# EAGLE design mpg-200-prototype_v3-with-logo (EAGLE 7.2.0)
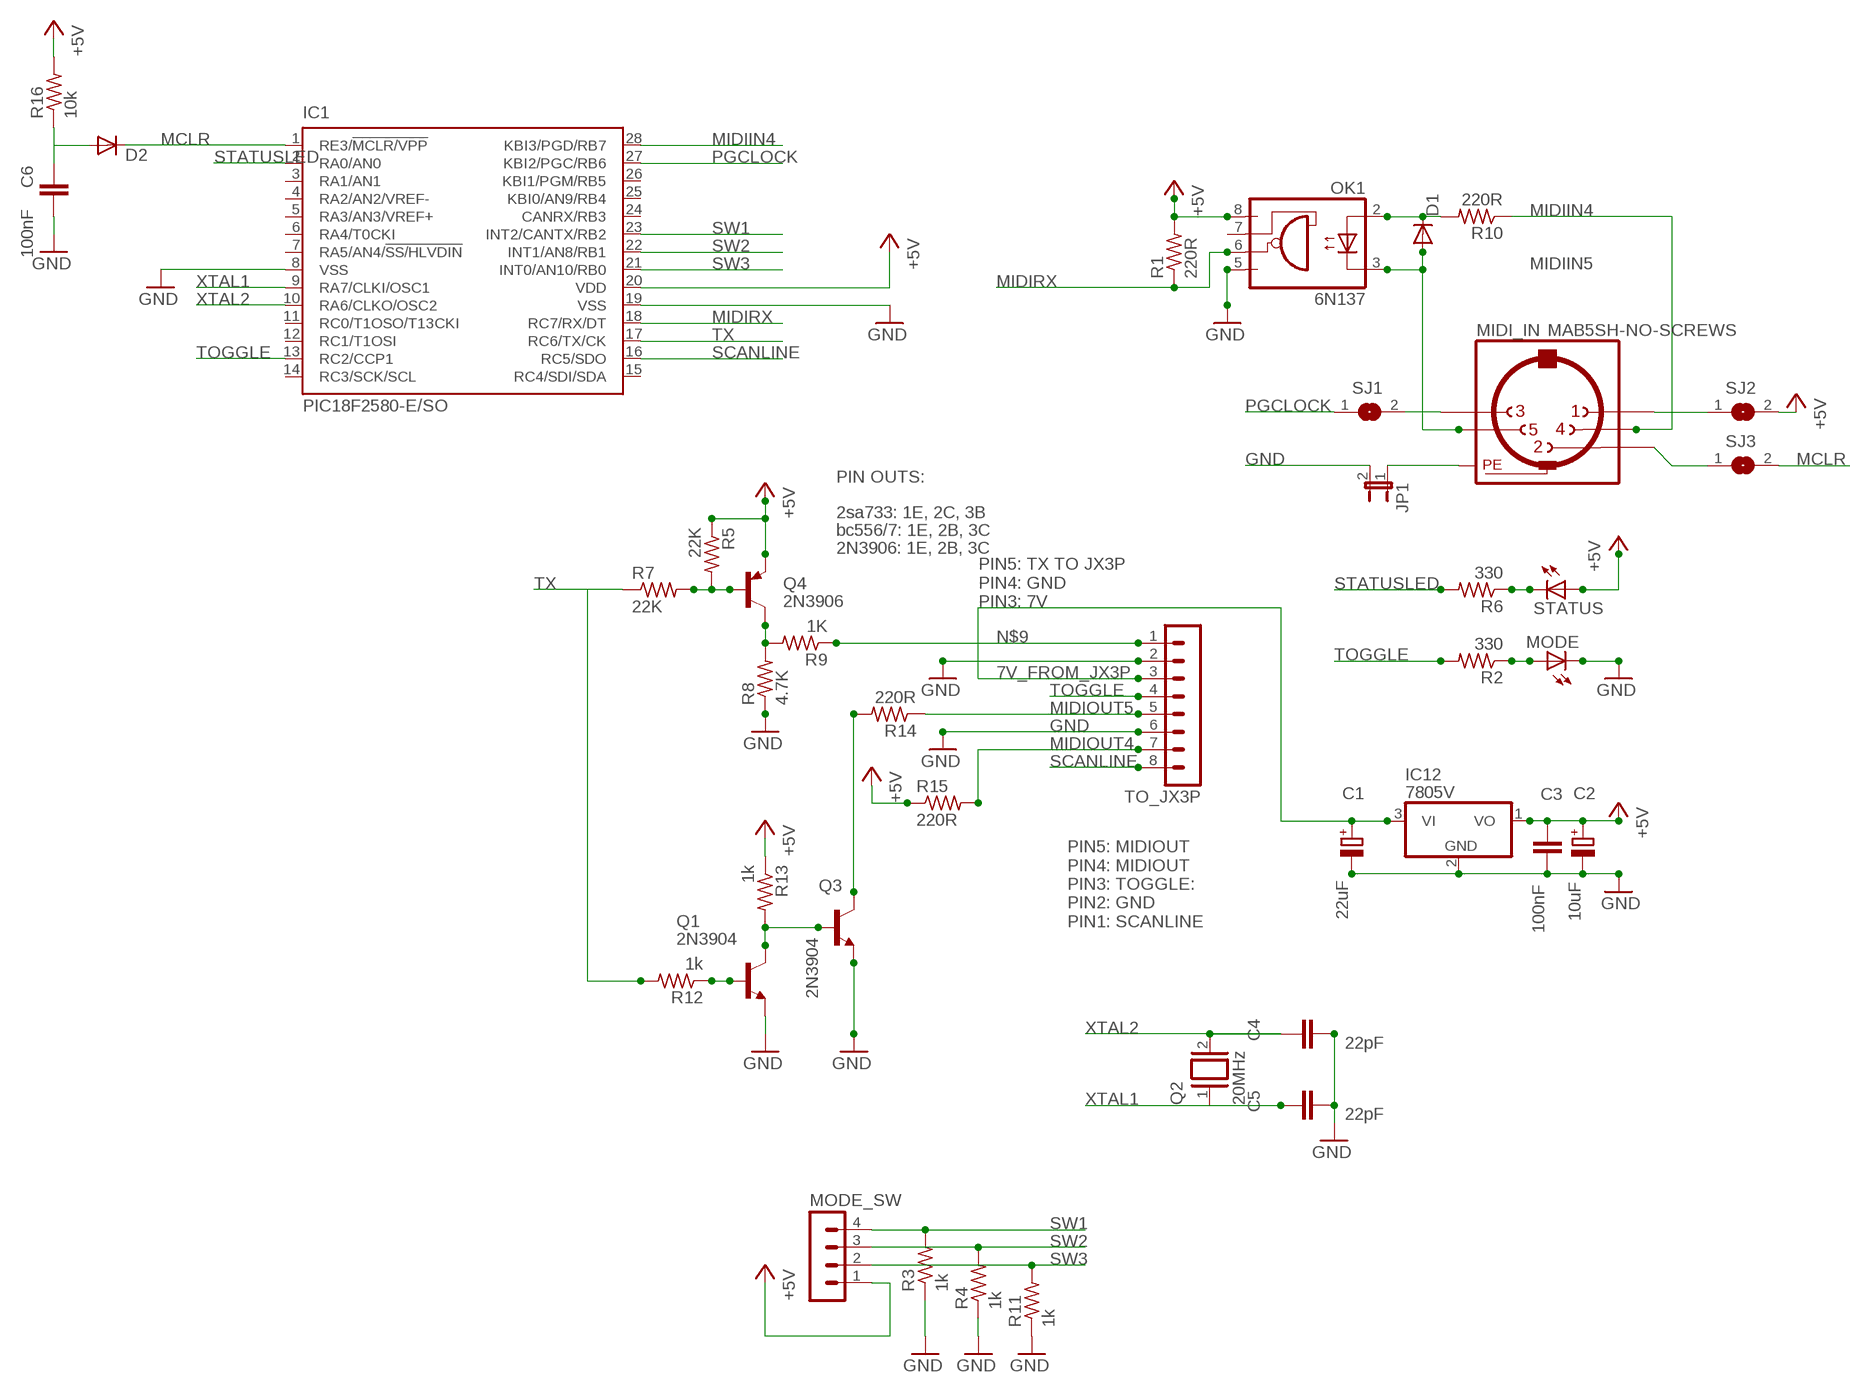
[diagram p0: schematic, sheet 1]

## Parts
C1  22uF  CPOL-EUE2.5-5  [E2,5-5]
C2  10uF  CPOL-EUE2.5-5  [E2,5-5]
C3  100nF  C-EUC0805  [C0805]
C4  22pF  C-EUC0805  [C0805]
C5  22pF  C-EUC0805  [C0805]
C6  100nF  C-EUC0805  [C0805]
D1  DIODE-SOD80C  [SOD80C]
D2  DIODE-SOD80C  [SOD80C]
IC1  PIC18F2580-E/SO  [SO28W]
IC12  7805V  7805L  [TO92]
JP1  JP1E  [JP1]
MIDI_IN  MAB5SH-NO-SCREWS  [MAB5SH-NO-SCREWS]
MODE  LED3MM  [LED3MM]
MODE_SW  MA04-1  [MA04-1]
OK1  6N137  [DIL08]
Q1  2N3904  [TO92]
Q2  20MHz  XTAL/S  [QS]
Q3  2N3904  [TO92]
Q4  2N3906  [TO92]
R1  220R  R-US_R0805  [R0805]
R2  330  R-US_R0805  [R0805]
R3  1k  R-US_R0805  [R0805]
R4  1k  R-US_R0805  [R0805]
R5  22K  R-US_R0805  [R0805]
R6  330  R-US_R0805  [R0805]
R7  22K  R-US_R0805  [R0805]
R8  4.7K  R-US_R0805  [R0805]
R9  1K  R-US_R0805  [R0805]
R10  220R  R-US_R0805  [R0805]
R11  1k  R-US_R0805  [R0805]
R12  1k  R-US_R0805  [R0805]
R13  1k  R-US_R0805  [R0805]
R14  220R  R-US_R0805  [R0805]
R15  220R  R-US_R0805  [R0805]
R16  10k  R-US_R0805  [R0805]
SJ1  SJ  [SJ]
SJ2  SJ  [SJ]
SJ3  SJ  [SJ]
STATUS  LED3MM  [LED3MM]
TO_JX3P  MA08-1  [MA08-1]

## Nets
7V_FROM_JX3P: C1.+ IC12.3(VI) TO_JX3P.3
+5V: C2.+ C3.1 IC1.20(VDD) IC12.1(VO) MODE_SW.1 OK1.8(VCC) Q4.1(E) R1.2 R5.1 R13.1 R15.1 R16.2 SJ2.2 STATUS.A
GND: C1.- C2.- C3.2 C4.2 C5.2 C6.2 IC1.8(VSS) IC1.19(VSS) IC12.2(GND) JP1.2 MODE.K(C) OK1.5(GND) Q1.1(E) Q3.1(E) R3.1 R4.1 R8.1 R11.1 TO_JX3P.2 TO_JX3P.6
MCLR: D2.C IC1.1(RE3/!MCLR/VPP) SJ3.2
MIDIIN4: IC1.28(KBI3/PGD/RB7) MIDI_IN.4 R10.1
MIDIIN5: D1.A MIDI_IN.5 OK1.3(C)
MIDIOUT4: R15.2 TO_JX3P.7
MIDIOUT5: R14.1 TO_JX3P.5
MIDIRX: IC1.18(RC7/RX/DT) OK1.6(VO) R1.1
N$1: R6.1 STATUS.K(C)
N$2: Q4.2(B) R5.2 R7.2
N$3: MODE.A R2.1
N$4: Q1.2(B) R12.1
N$5: D1.C OK1.2(A) R10.2
N$6: Q4.3(C) R8.2 R9.2
N$7: Q1.3(C) Q3.2(B) R13.2
N$8: Q3.3(C) R14.2
N$9: R9.1 TO_JX3P.1
N$10: MIDI_IN.3 SJ1.2
N$11: MIDI_IN.2 SJ3.1
N$12: MIDI_IN.1 SJ2.1
N$13: JP1.1 MIDI_IN.PE MIDI_IN.PE@(PE)
N$14: C6.1 D2.A R16.1
PGCLOCK: IC1.27(KBI2/PGC/RB6) SJ1.1
SCANLINE: IC1.16(RC5/SDO) TO_JX3P.8
STATUSLED: IC1.2(RA0/AN0) R6.2
SW1: IC1.23(INT2/CANTX/RB2) MODE_SW.4 R3.2
SW2: IC1.22(INT1/AN8/RB1) MODE_SW.3 R4.2
SW3: IC1.21(INT0/AN10/RB0) MODE_SW.2 R11.2
TOGGLE: IC1.13(RC2/CCP1) R2.2 TO_JX3P.4
TX: IC1.17(RC6/TX/CK) R7.1 R12.2
XTAL1: C5.1 IC1.9(RA7/CLKI/OSC1) Q2.1
XTAL2: C4.1 IC1.10(RA6/CLKO/OSC2) Q2.2
Unconnected: IC1.3(RA1/AN1) IC1.4(RA2/AN2/VREF-) IC1.5(RA3/AN3/VREF+) IC1.6(RA4/T0CKI) IC1.7(RA5/AN4/!SS/HLVDIN) IC1.11(RC0/T1OSO/T13CKI) IC1.12(RC1/T1OSI) IC1.14(RC3/SCK/SCL) IC1.15(RC4/SDI/SDA) IC1.24(CANRX/RB3) IC1.25(KBI0/AN9/RB4) IC1.26(KBI1/PGM/RB5) OK1.7(VE)

## Notes on the sheet
- PIN OUTS:
- 2sa733: 1E, 2C, 3B
- bc556/7: 1E, 2B, 3C
- 2N3906: 1E, 2B, 3C
- PIN5: TX TO JX3P
  PIN4: GND
  PIN3: 7V
- PIN5: MIDIOUT
  PIN4: MIDIOUT
  PIN3: TOGGLE:
  PIN2: GND
  PIN1: SCANLINE

## Library data of the parts
C1 C2 = rcl:CPOL-EU: POLARIZED CAPACITOR, European symbol
C3-C6 = resistor:C-EU: CAPACITOR, European symbol
D1 D2 = diode:DIODE-: DIODE
IC1 = microchip:PIC18F2*80: 28-Pin Enhanced Flash Microcontrollers with ECAN(TM) Technology 10-Bit A/D and nanoWatt Technology Source: http://www.microchip.com .. 39637a.pdf; MF: MICROCHIP; MPN: PIC18F2580-I/SO; OC_FARNELL: 9321284; OC_NEWARK: 71J7243
IC12 = joakim:78*: Positive VOLTAGE REGULATOR Source: http://cache.national.com/ds/LM/LM78L05.pdf http://www.fairchildsemi.com/ds/LM/LM7805.pdf
JP1 = jumper:JP1E: JUMPER
MIDI_IN = joakim:MAB5SH-NO-SCREWS: Female CONNECTOR 5 pins 90 deg. with shield, horizontal (DIN 41524); OC_FARNELL: 809883; OC_NEWARK: unknown
MODE STATUS = led:LED: LED OSRAM: - CHIPLED LG R971, LG N971, LY N971, LG Q971, LY Q971, LO R971, LY R971 LH N974, LH R974 LS Q976, LO Q976, LY Q976 LO Q996 - Hyper CHIPLED LW Q18S LB Q993, LB Q99A, LB R99A - SideLED LS A670, LO A670, LY A670, LG A670, LP A670 LB A673, LV A673, LT A673, LW A673 LH A674 LY A675 LS A676, LA A676, LO A676, LY A676, LW A676 LS A679, LY A679, LG A679 - Hyper Micro SIDELED® LS Y876, LA Y876, LO Y876, LY Y876 LT Y87S - SmartLED LW L88C, LW L88S LB L89C, LB L89S, LG L890 LS L89K, LO L89K, LY L89K LS L896, LA L896, LO L896, LY L896 - TOPLED LS T670, LO T670, LY T670, LG T670, LP T670 LSG T670, LSP T670, LSY T670, LOP T670, LYG T670 LG T671, LOG T671, LSG T671 LB T673, LV T673, LT T673, LW T673 LH T674 LS T676, LA T676, LO T676, LY T676, LB T676, LH T676, LSB T676, LW T676 LB T67C, LV T67C, LT T67C, LS T67K, LO T67K, LY T67K, LW E67C LS E67B, LA E67B, LO E67B, LY E67B, LB E67C, LV E67C, LT E67C LW T67C LS T679, LY T679, LG T679 LS T770, LO T770, LY T770, LG T770, LP T770 LB T773, LV T773, LT T773, LW T773 LH T774 LS E675, LA E675, LY E675, LS T675 LS T776, LA T776, LO T776, LY T776, LB T776 LHGB T686 LT T68C, LB T68C - Hyper Mini TOPLED® LB M676 - Mini TOPLED Santana® LG M470 LS M47K, LO M47K, LY M47K Source: http://www.osram.convergy.de LUXEON: - LUMILED® LXK2-PW12-R00, LXK2-PW12-S00, LXK2-PW14-U00, LXK2-PW14-V00 LXK2-PM12-R00, LXK2-PM12-S00, LXK2-PM14-U00 LXK2-PE12-Q00, LXK2-PE12-R00, LXK2-PE12-S00, LXK2-PE14-T00, LXK2-PE14-U00 LXK2-PB12-K00, LXK2-PB12-L00, LXK2-PB12-M00, LXK2-PB14-N00, LXK2-PB14-P00, LXK2-PB14-Q00 LXK2-PR12-L00, LXK2-PR12-M00, LXK2-PR14-Q00, LXK2-PR14-R00 LXK2-PD12-Q00, LXK2-PD12-R00, LXK2-PD12-S00 LXK2-PH12-R00, LXK2-PH12-S00 LXK2-PL12-P00, LXK2-PL12-Q00, LXK2-PL12-R00 Source: www.luxeon.com KINGBRIGHT: KA-3528ASYC Source: www.kingbright.com
MODE_SW = con-lstb:MA04-1: PIN HEADER; OC_FARNELL: unknown; OC_NEWARK: unknown
OK1 = optocoupler:6N137: MOTOROLA OPTO COUPLER
Q1 Q3 = joakim:2N3904: NPN Transistor
Q2 = special:XTAL/S: CRYSTAL
Q4 = joakim:2N3906: PNP Transistor
R1-R16 = resistor:R-US_: RESISTOR, American symbol
SJ1-SJ3 = jumper:SJ: SMD solder JUMPER
TO_JX3P = con-lstb:MA08-1: PIN HEADER

## Board
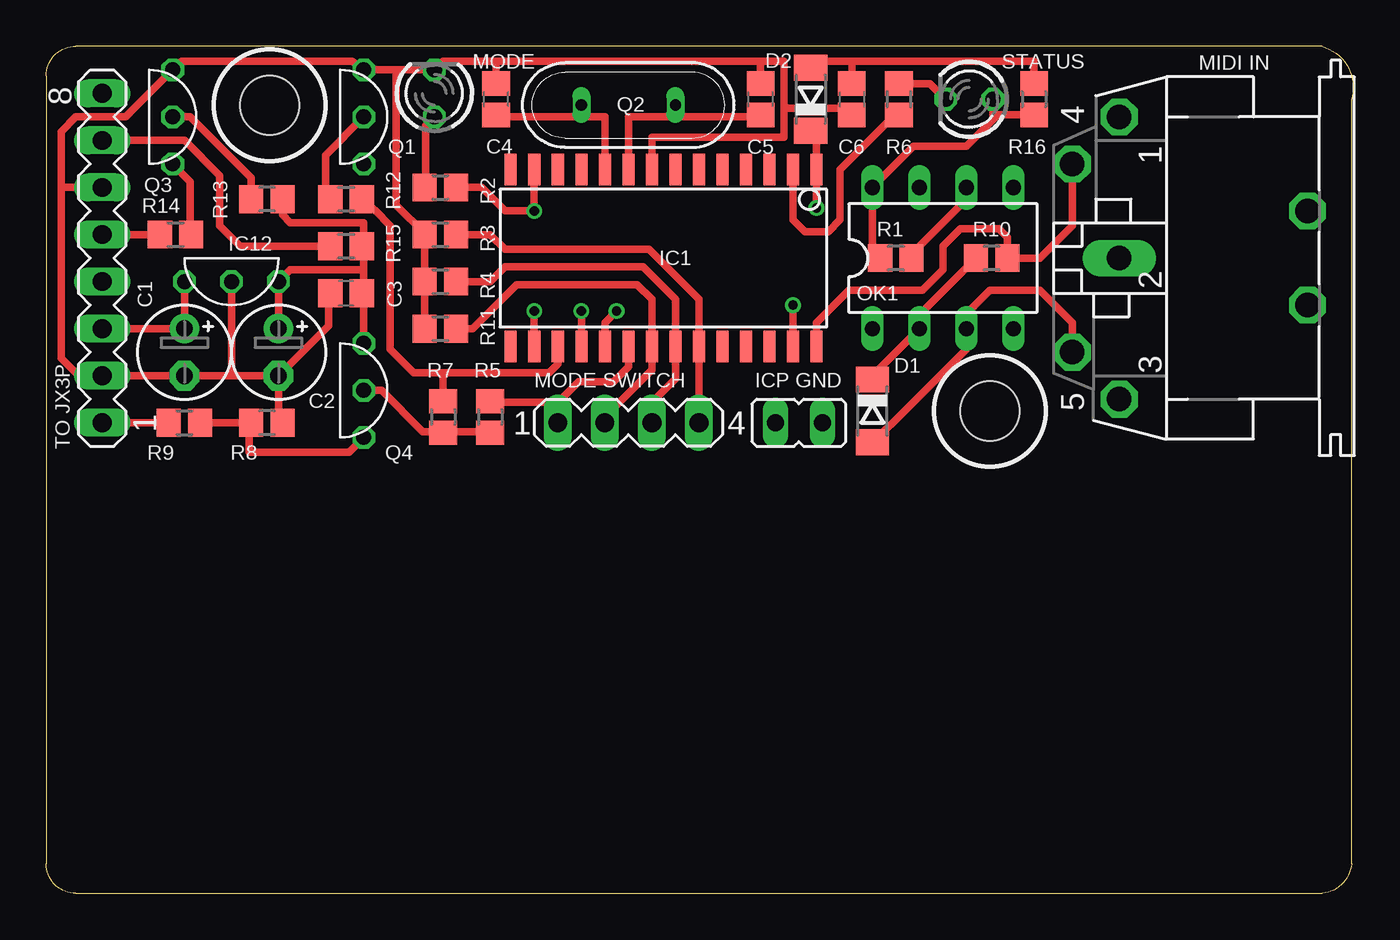
[diagram p1: board, top side]
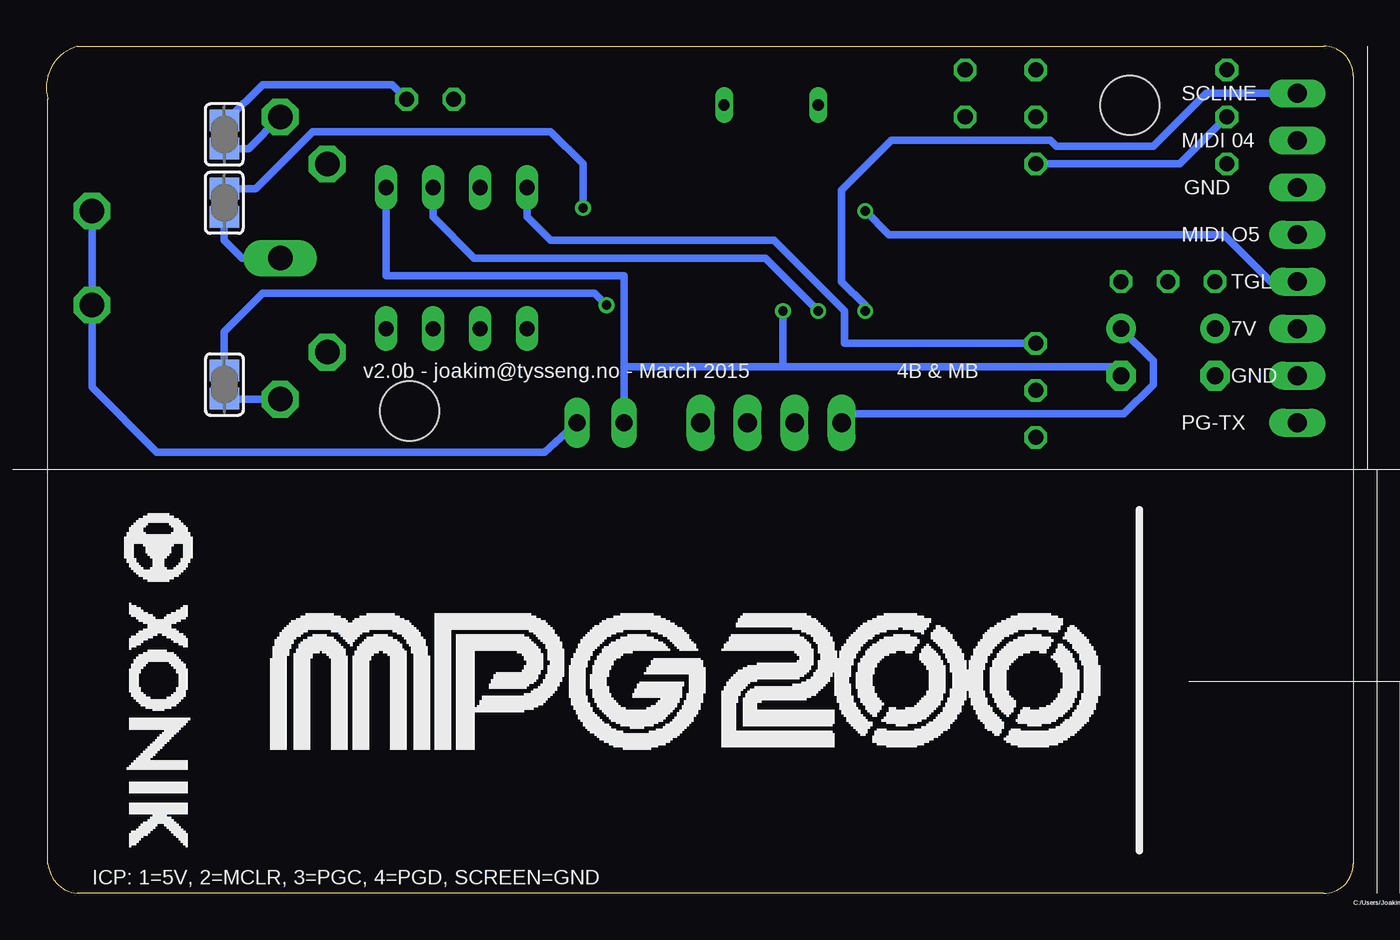
[diagram p2: board, bottom side, seen from below]

Size 70.57 x 45.72 mm. Coordinates in mm from the lower left corner, seen from the top.
Outline: 1.59,0 68.9,0 arc80 70.48,1.59 70.48,42.86 arc90 68.9,45.72 1.59,45.72 arc90 0,44.13 0,1.59 arc90 1.59,0
Copper layers (1*16): Top 0.0356mm / dielectric 1.5011mm / Bottom 0.0356mm
Design rules "default": minimum track width 6mil, minimum drill 13mil, track to track 6mil, track to pad 6mil, pad to pad 6mil, via to via 6mil, smd to smd 6mil, copper to edge 15mil, drill to drill 6mil, minimum pad ring 7mil, minimum via ring 7mil, stop-mask expansion 3mil, vias tented up to drill 0mil, thermal gap 10mil
Holes 3.2 mm at 50.96,26.04 12.06,42.55

### Footprints (pad centres in the part's own frame; a part is rotated, then mirrored left to right if it is on the bottom)
E2,5-5 = drill 0.9 pad 1.6: + -1.27,0 | drill 0.9 pad 1.6 octagon: - 1.27,0
C0805 = smd 1.3 x 1.5: 1 -0.85,0; 2 0.85,0
SOD80C = smd 1.4 x 1.8: A 1.7,0; C -1.7,0
SO28W = smd 0.65 x 1.7: 1 -7.62,-4.78; 2 -6.35,-4.78; 3 -5.08,-4.78; 4 -3.81,-4.78; 5 -2.54,-4.78; 6 -1.27,-4.78; 7 0,-4.78; 8 1.27,-4.78; 9 2.54,-4.78; 10 3.81,-4.78; 11 5.08,-4.78; 12 6.35,-4.78; 13 7.62,-4.78; 14 8.89,-4.78; 15 8.89,4.78; 16 7.62,4.78; 17 6.35,4.78; 18 5.08,4.78; 19 3.81,4.78; 20 2.54,4.78; 21 1.27,4.78; 22 0,4.78; 23 -1.27,4.78; 24 -2.54,4.78; 25 -3.81,4.78; 26 -5.08,4.78; 27 -6.35,4.78; 28 -7.62,4.78
TO92 = drill 0.813 octagon: 1 -2.54,0; 2 0,0; 3 2.54,0
JP1 = drill 0.914 long: 1 0,-1.27; 2 0,1.27
MAB5SH-NO-SCREWS = drill 1.321 octagon: 1 7.62,5.08; 3 -7.62,5.08; 4 5.08,7.62; 5 -5.08,7.62; PE -2.54,-5.08; PE@ 2.54,-5.08 | drill 1.321 long: 2 0,5.08
LED3MM = drill 0.813 octagon: A -1.27,0; K 1.27,0
MA04-1 = drill 1.016 long: 1 -3.81,0; 2 -1.27,0; 3 1.27,0; 4 3.81,0
DIL08 = drill 0.813 long: 1 -3.81,-3.81; 2 -1.27,-3.81; 3 1.27,-3.81; 4 3.81,-3.81; 5 3.81,3.81; 6 1.27,3.81; 7 -1.27,3.81; 8 -3.81,3.81
QS = drill 0.61 long: 1 -2.54,0; 2 2.54,0
R0805 = smd 1.3 x 1.5: 1 -0.85,0; 2 0.85,0
SJ = smd 1.168 x 1.6: 1 -0.762,0; 2 0.762,0
MA08-1 = drill 1.016 long: 1 -8.89,0; 2 -6.35,0; 3 -3.81,0; 4 -1.27,0; 5 1.27,0; 6 3.81,0; 7 6.35,0; 8 8.89,0

### Placement (x,y rotation side)
C1  7.46,29.21 270 top
C2  12.54,29.21 270 top
C3  16.19,32.38 180 top
C4  24.29,42.86 90 top
C5  38.58,42.86 90 top
C6  43.5,42.86 270 top
D1  44.61,26.04 270 top
D2  41.27,42.86 90 top
IC1  33.97,34.29 180 top
IC12  10,33.02 180 top
JP1  40.64,25.4 90 top
MIDI_IN  63.02,34.29 90 top
MODE  20.95,43.18 90 top
MODE_SW  31.43,25.4 0 top
OK1  48.42,34.29 0 top
Q1  17.14,41.91 270 top
Q2  31.43,42.55 180 top
Q3  6.83,41.91 270 top
Q4  17.14,27.15 270 top
R1  45.88,34.29 180 top
R2  21.27,38.1 0 top
R3  21.27,35.56 0 top
R4  21.27,33.02 0 top
R5  23.97,25.72 270 top
R6  46.04,42.86 270 top
R7  21.43,25.72 270 top
R8  11.91,25.4 180 top
R9  7.46,25.4 0 top
R10  51.05,34.29 180 top
R11  21.27,30.48 0 top
R12  16.19,37.47 0 top
R13  11.91,37.47 180 top
R14  6.99,35.56 0 top
R15  16.19,34.92 180 top
R16  53.34,42.86 270 top
SJ1  60.96,27.46 270 bottom
SJ2  60.96,40.96 90 bottom
SJ3  60.96,37.27 90 bottom
STATUS  49.85,42.86 180 top
TO_JX3P  3.02,34.29 90 top

### Tracks (layer width: path | path; a pad name or v marks a point on that pad's centre or on a via)
7V_FROM_JX3P
  Top 0.406: IC12.3 C1.+ TO_JX3P.3
+5V
  Top 0.406: 17.14,33.66 17.14,35.24 17.04,35.34 R15.1 17.14,35.03 17.14,36.2 13.18,36.2 12.76,36.62 R13.1 | 17.14,33.66 17.14,33.12 C3.1 17.04,32.8 17.14,32.7 Q4.1 | 17.14,33.66 13.18,33.66 IC12.1 C2.+ | R1.2 44.93,34.29 44.61,34.61 OK1.8 46.83,40.32 49.69,40.32 51.12,41.75 | 27.62,26.51 28.73,27.62 30.64,27.62 31.43,28.42 IC1.20 | 27.62,26.51 24.23,26.51 R5.1 | 27.62,26.51 MODE_SW.1 | STATUS.A 51.12,41.75 | R16.2 51.38,42.01 51.12,41.75
  Bottom 0.406: Q4.1 27.46,29.69 27.46,31.43 31.27,35.24 43.34,35.24 44.61,36.51 OK1.8 | MODE_SW.1 27.62,25.88 12.38,25.88 10.79,27.46 10.79,28.73 C2.+ | SJ2.2 60.83,41.72 58.9,43.66 51.91,43.66 STATUS.A
GND  (via drill 0.5)
  Top 0.406: R8.1 12.54,25.4 C2.- | C2.- 15.24,30.64 15.24,32.92 C3.2 | IC12.2 10,27.94 | 10,27.94 C1.- TO_JX3P.2 1.75,27.94 0.79,28.89 0.79,38.1 | 10,27.94 C2.- | 0.79,38.1 0.79,41.12 1.59,41.91 4.29,41.91 Q3.1 7.3,44.93 16.51,44.93 Q1.1 18.89,44.45 | TO_JX3P.6 0.79,38.1 | 18.89,44.45 MODE.K 21.43,44.93 24.29,44.93 | IC1.8 32.7,40.8 39.85,40.8 39.85,42.55 | 24.29,44.93 38.58,44.93 | C5.2 38.58,44.93 | 38.58,44.93 39.85,44.93 39.85,42.55 | C4.2 24.29,44.93 | 18.89,44.45 18.89,37.15 20.42,35.62 R11.1 R4.1 R3.1 | IC1.19 30.16,30.8 v30.8,31.43 | C6.2 43.24,42.01 42.86,42.39 40.01,42.39 39.85,42.55
  Bottom 0.406: v30.8,31.43 30.8,28.42 | 30.8,28.42 13.02,28.42 C2.- | 30.8,28.42 39.21,28.42 | 39.21,28.42 39.37,28.42 JP1.2 | OK1.5 52.23,33.34 39.37,33.34 39.37,28.57 39.21,28.42
MCLR  (via drill 0.5)
  Top 0.406: v41.59,36.99 IC1.1 41.59,41.12 41.55,41.16 D2.C
  Bottom 0.406: SJ3.2 59.28,38.04 56.2,41.12 43.34,41.12 41.59,39.37 v41.59,36.99
MIDIIN4
  Top 0.406: MIDI_IN.4 55.4,36.04 53.66,34.29 R10.1 51.91,34.3 51.91,35.4 51.44,35.88 49.37,35.88 48.42,34.92 48.42,33.66 47.31,32.54 43.34,32.54 41.59,30.8 IC1.28
MIDIIN5
  Top 0.406: D1.A 44.72,24.45 45.88,25.56 49.69,29.37 OK1.3 49.69,31.27 50.96,32.54 53.66,32.54 55.4,30.8 MIDI_IN.5
MIDIOUT4
  Top 0.406: R15.2 10.48,34.92 9.37,36.04 9.37,38.73 7.46,40.64 TO_JX3P.7
MIDIOUT5
  Top 0.406: TO_JX3P.5 R14.1
MIDIRX  (via drill 0.5)
  Top 0.406: R1.1 46.73,34.51 49.69,37.47 OK1.6 | IC1.18 v28.89,31.43
  Bottom 0.406: v28.89,31.43 31.75,34.29 47.47,34.29 49.69,36.51 OK1.6
N$1
  Top 0.406: R6.1 47.73,43.71 STATUS.K
N$2
  Top 0.406: Q4.2 18.1,27.15 20.32,24.92 21.27,24.92 21.33,25.08 R7.2 21.43,24.92 23.87,24.92 R5.2
N$3
  Top 0.406: MODE.A 20.48,41.43 20.48,38.31 R2.1
N$4
  Top 0.406: Q1.2 15.08,39.85 15.08,37.73 R12.1
N$5
  Top 0.406: D1.C 44.72,28.05 OK1.2 47.15,31.23 R10.2
N$6
  Top 0.406: Q4.3 16.35,23.81 10.95,23.81 10.95,25.3 R8.2 R9.2
N$7
  Top 0.406: Q3.2 7.78,41.91 11.06,38.63 R13.2
  Bottom 0.406: Q1.3 9.37,39.37 Q3.2
N$8
  Top 0.406: Q3.3 7.78,38.42 7.78,35.14 R14.2
N$9
  Top 0.406: TO_JX3P.1 R9.1
N$10
  Bottom 0.406: MIDI_IN.3 60.93,26.67 SJ1.2
N$11
  Bottom 0.406: MIDI_IN.2 60.01,34.29 60.96,35.24 SJ3.1
N$12
  Bottom 0.406: SJ2.1 59.66,40.2 MIDI_IN.1
N$13
  Bottom 0.406: JP1.1 43.66,23.81 64.61,23.81 68.1,27.3 MIDI_IN.PE MIDI_IN.PE@
N$14
  Top 0.406: R16.1 53.34,44.93 43.5,44.93 | 43.5,44.93 41.64,44.93 D2.A | C6.1 43.5,44.93
PGCLOCK  (via drill 0.5)
  Top 0.406: v40.32,31.75 IC1.27
  Bottom 0.406: SJ1.1 60.96,30.32 58.9,32.38 40.96,32.38 v40.32,31.75
SCANLINE  (via drill 0.5)
  Top 0.406: v26.35,31.43 IC1.16
  Bottom 0.406: TO_JX3P.8 7.94,43.18 10.79,40.32 16.03,40.32 16.35,40.64 24.92,40.64 27.62,37.94 27.62,33.02 26.35,31.75 v26.35,31.43
STATUSLED
  Top 0.406: IC1.2 40.32,36.35 40.96,35.72 42.23,35.72 42.86,36.35 42.86,39.05 45.88,42.07 R6.2
SW1
  Top 0.406: MODE_SW.4 IC1.23 35.24,32.07 32.54,34.77 24.77,34.77 23.97,35.56 R3.2
SW2
  Top 0.406: MODE_SW.3 32.7,26.51 33.97,27.78 IC1.22 33.97,32.07 32.23,33.81 24.77,33.81 23.97,33.02 R4.2
SW3
  Top 0.406: MODE_SW.2 30.16,25.72 32.7,28.26 IC1.21 32.7,32.07 31.91,32.86 25.4,32.86 23.02,30.48 R11.2
TOGGLE  (via drill 0.5)
  Top 0.406: IC1.13 v26.35,36.83 24.77,36.83 23.5,38.1 R2.2
  Bottom 0.406: TO_JX3P.4 4.45,33.02 6.99,35.56 25.08,35.56 v26.35,36.83
TX
  Top 0.406: R12.2 17.78,36.83 18.57,36.04 18.57,29.37 19.84,28.1 21.43,28.1 | R7.1 21.33,26.99 21.33,26.93 21.43,26.83 21.43,28.1 | IC1.17 27.62,28.57 27.15,28.1 21.43,28.1
XTAL1
  Top 0.406: IC1.9 31.43,41.91 33.97,41.91 Q2.1 34.13,41.91 38.47,41.91 C5.1
XTAL2
  Top 0.406: IC1.10 30.16,41.91 28.89,41.91 | 24.34,41.75 C4.1 24.39,41.91 28.89,41.91 | Q2.2 28.89,41.91

### Text on the board
tNames: MIDI IN | MODE SWITCH | ICP GND | TO JX3P
bNames: SCLINE | MIDI 04 | GND | MIDI O5 | TGL | 7V | GND | 4B & MB | v2.0b - joakim@tysseng.no - March 2015 | PG-TX | ICP: 1=5V, 2=MCLR, 3=PGC, 4=PGD, SCREEN=GND | C:/Users/Joakim/Documents/Elektronikk og synth/Logoer/mpg-200-45mm-mirrored.bmp | C:/Users/Joakim/Google Drive/elektro/eagle projects/Logos/xonik-logo-monocrome-18 mm 200 dpi.bmp